# Altium schematic sheet Sheet1.SchDoc
size A; SheetNumber: 1; SheetTotal: 1; SPICEModelCacheXMSPVYCF: <root> / <DocumentId>XMSPVYCF</DocumentId> / <CacheFrame Number="0"> / <Model Name="led0" Kind="MDL"> / <Text>*Typ INFRARED GaAs LED: Vf=1.2V Vr=5V If=40mA trr=3uS / *LED Pinout: 1=A, 2=K / .MODEL LED0 D (IS=93.5P RS=84M N=2.63 BV=5 IBV=10U / + CJO=2.97P VJ=.75 M=.333 TT=4.32U)</Text> / </Model> / </CacheFrame> / </root>
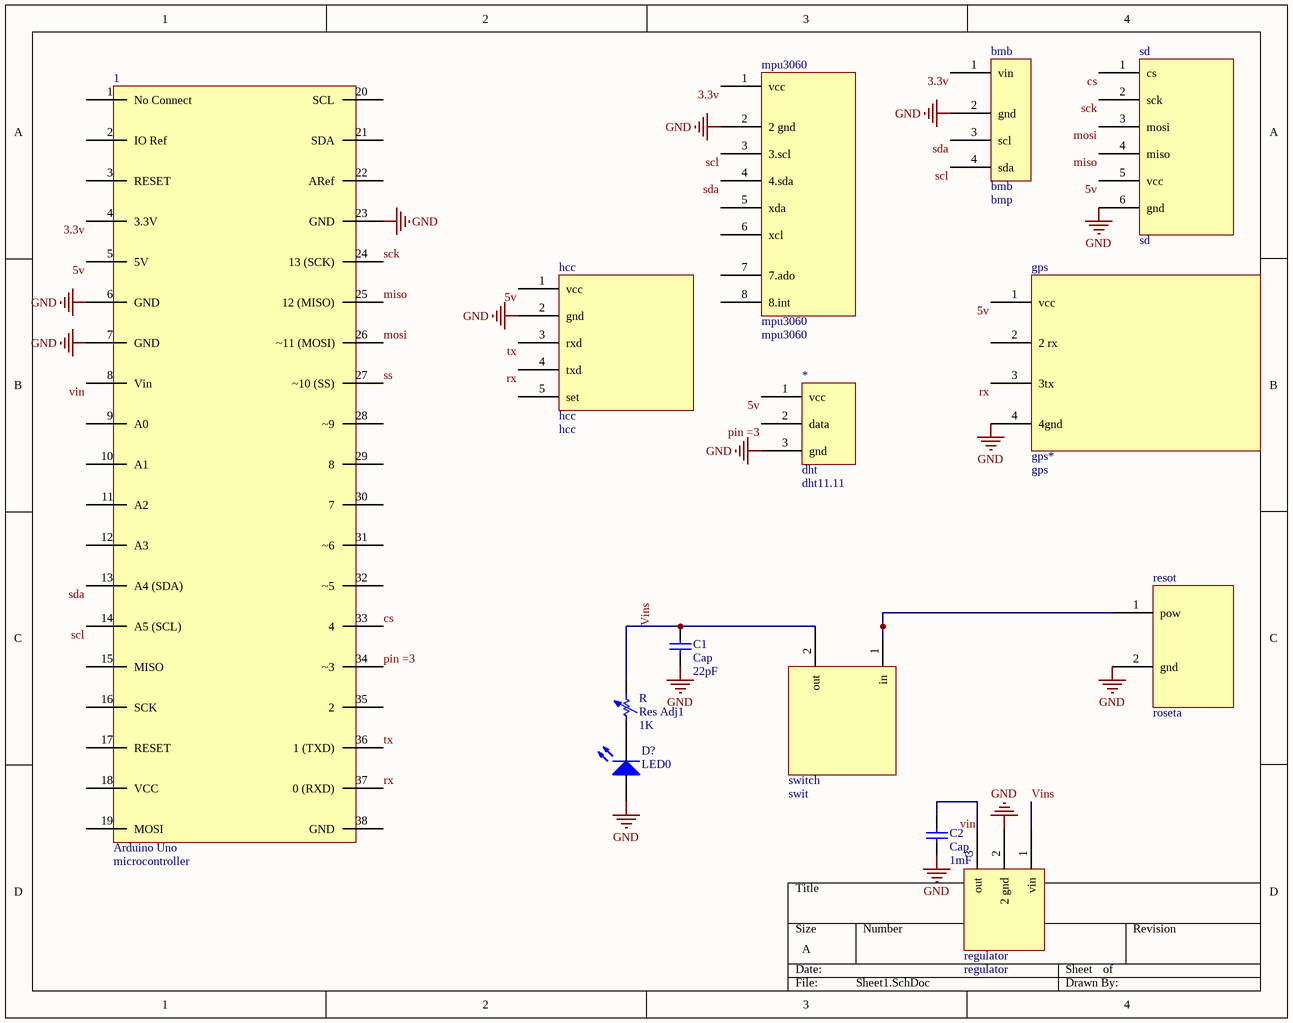
[diagram p0: Sheet1.SchDoc]

## Parts
1  Arduino Uno  Category: microcontroller  [Arduino Uno]
*  dht  [dht11.11]
bmb  bmb  [bmp - duplicate]
C1  Cap  value 22pF  [RAD-0.3]
C2  Cap  value 1mF  [RAD-0.3]
D?  LED0  [LED-0]
gps  gps*  [GPS]
hcc  hcc  [hc-12]
mpu3060  mpu3060  [mpu 6050.11]
R  Res Adj1  value 1K  [AXIAL-0.7]
regulator  regulator  [regylator]
resot  roseta  [roseta]
sd  sd  [sd - duplicate]
switch  swit  [switch]

## Nets
GND: 1.6(GND) 1.7(GND) 1.23(GND) *.3(gnd) bmb.2(gnd) C1.1 C2.1 D?.1(A) gps.4(4gnd) hcc.2(gnd) mpu3060.2(2_gnd) regulator.2(2_gnd) resot.2(gnd) sd.6(gnd)
3.3v: 1.4(3.3V) bmb.1(vin) mpu3060.1(vcc)
5v: 1.5(5V) *.1(vcc) gps.1(vcc) hcc.1(vcc) sd.5(vcc)
cs: 1.33(4) sd.1(cs)
miso: 1.25(12_(MISO)) sd.4(miso)
mosi: 1.26(~11_(MOSI)) sd.3(mosi)
pin =3: 1.34(~3) *.2(data)
rx: 1.37(0_(RXD)) gps.3(3tx) hcc.4(txd)
sck: 1.24(13_(SCK)) sd.2(sck)
scl: 1.14(A5_(SCL)) bmb.4(sda) mpu3060.3(3.scl)
sda: 1.13(A4_(SDA)) bmb.3(scl) mpu3060.4(4.sda)
ss: 1.27(~10_(SS))
tx: 1.36(1_(TXD)) hcc.3(rxd)
vin: 1.8(Vin) C2.2 regulator.3(out)
Vins: C1.2 R.2 regulator.1(vin) switch.2(out)
NetD?_2: D?.2(K) R.1
Netresot_1: resot.1(pow) switch.1(in)

Not connected (* = marked no-connect by the designer): 1 1(No_Connect) 2(IO_Ref) 3(RESET) 9(A0) 10(A1) 11(A2) 12(A3) 15(MISO) 16(SCK) 17(RESET) 18(VCC) 19(MOSI) 20(SCL) 21(SDA) 22(ARef) 28(~9) 29(8) 30(7) 31(~6) 32(~5) 35(2) 38(GND); gps 2(2_rx); hcc 5(set); mpu3060 5(xda) 6(xcl) 7(7.ado) 8(8.int)

## Library data of the parts
bmb = bmp: Parameter 1: *; catagorr: bmp
C1 C2 = Cap: Capacitor; Published: 8-Jun-2000; LatestRevisionDate: 17-Jul-2002; LatestRevisionNote: Re-released for DXP Platform.; PackageReference: RAD-0.3; Publisher: Altium Limited; PackageDescription: Radial Cap, Thru-Hole; 2 Leads; 0.3 in Pin Spacing
D? = LED0: Typical INFRARED GaAs LED; Published: 8-Jun-2000; LatestRevisionDate: 08-Jul-2005; LatestRevisionNote: Mech Layer 1 removed.; PackageReference: LED-0; Publisher: Altium Limited; PackageDescription: LED; 2 Leads
gps = gps.neo.6m: gps: gps
hcc = hc 12: hcc: hcc
mpu3060 = mpu: categore: mpu3060
R = Res Adj1: Variable Resistor; Set Position: 0.5; Published: 8-Jun-2000; LatestRevisionDate: 17-Jul-2002; LatestRevisionNote: Re-released for DXP Platform.; PackageReference: AXIAL-0.7; Publisher: Altium Limited; PackageDescription: Axial Device, Thru-Hole; 2 Leads; 0.7 in Pin Spacing
* = dht: catagory: dht11.11
sd = sd: sd: sd